# Altium project MiniPC MB GOST.PrjPcb (part 28 of 31)
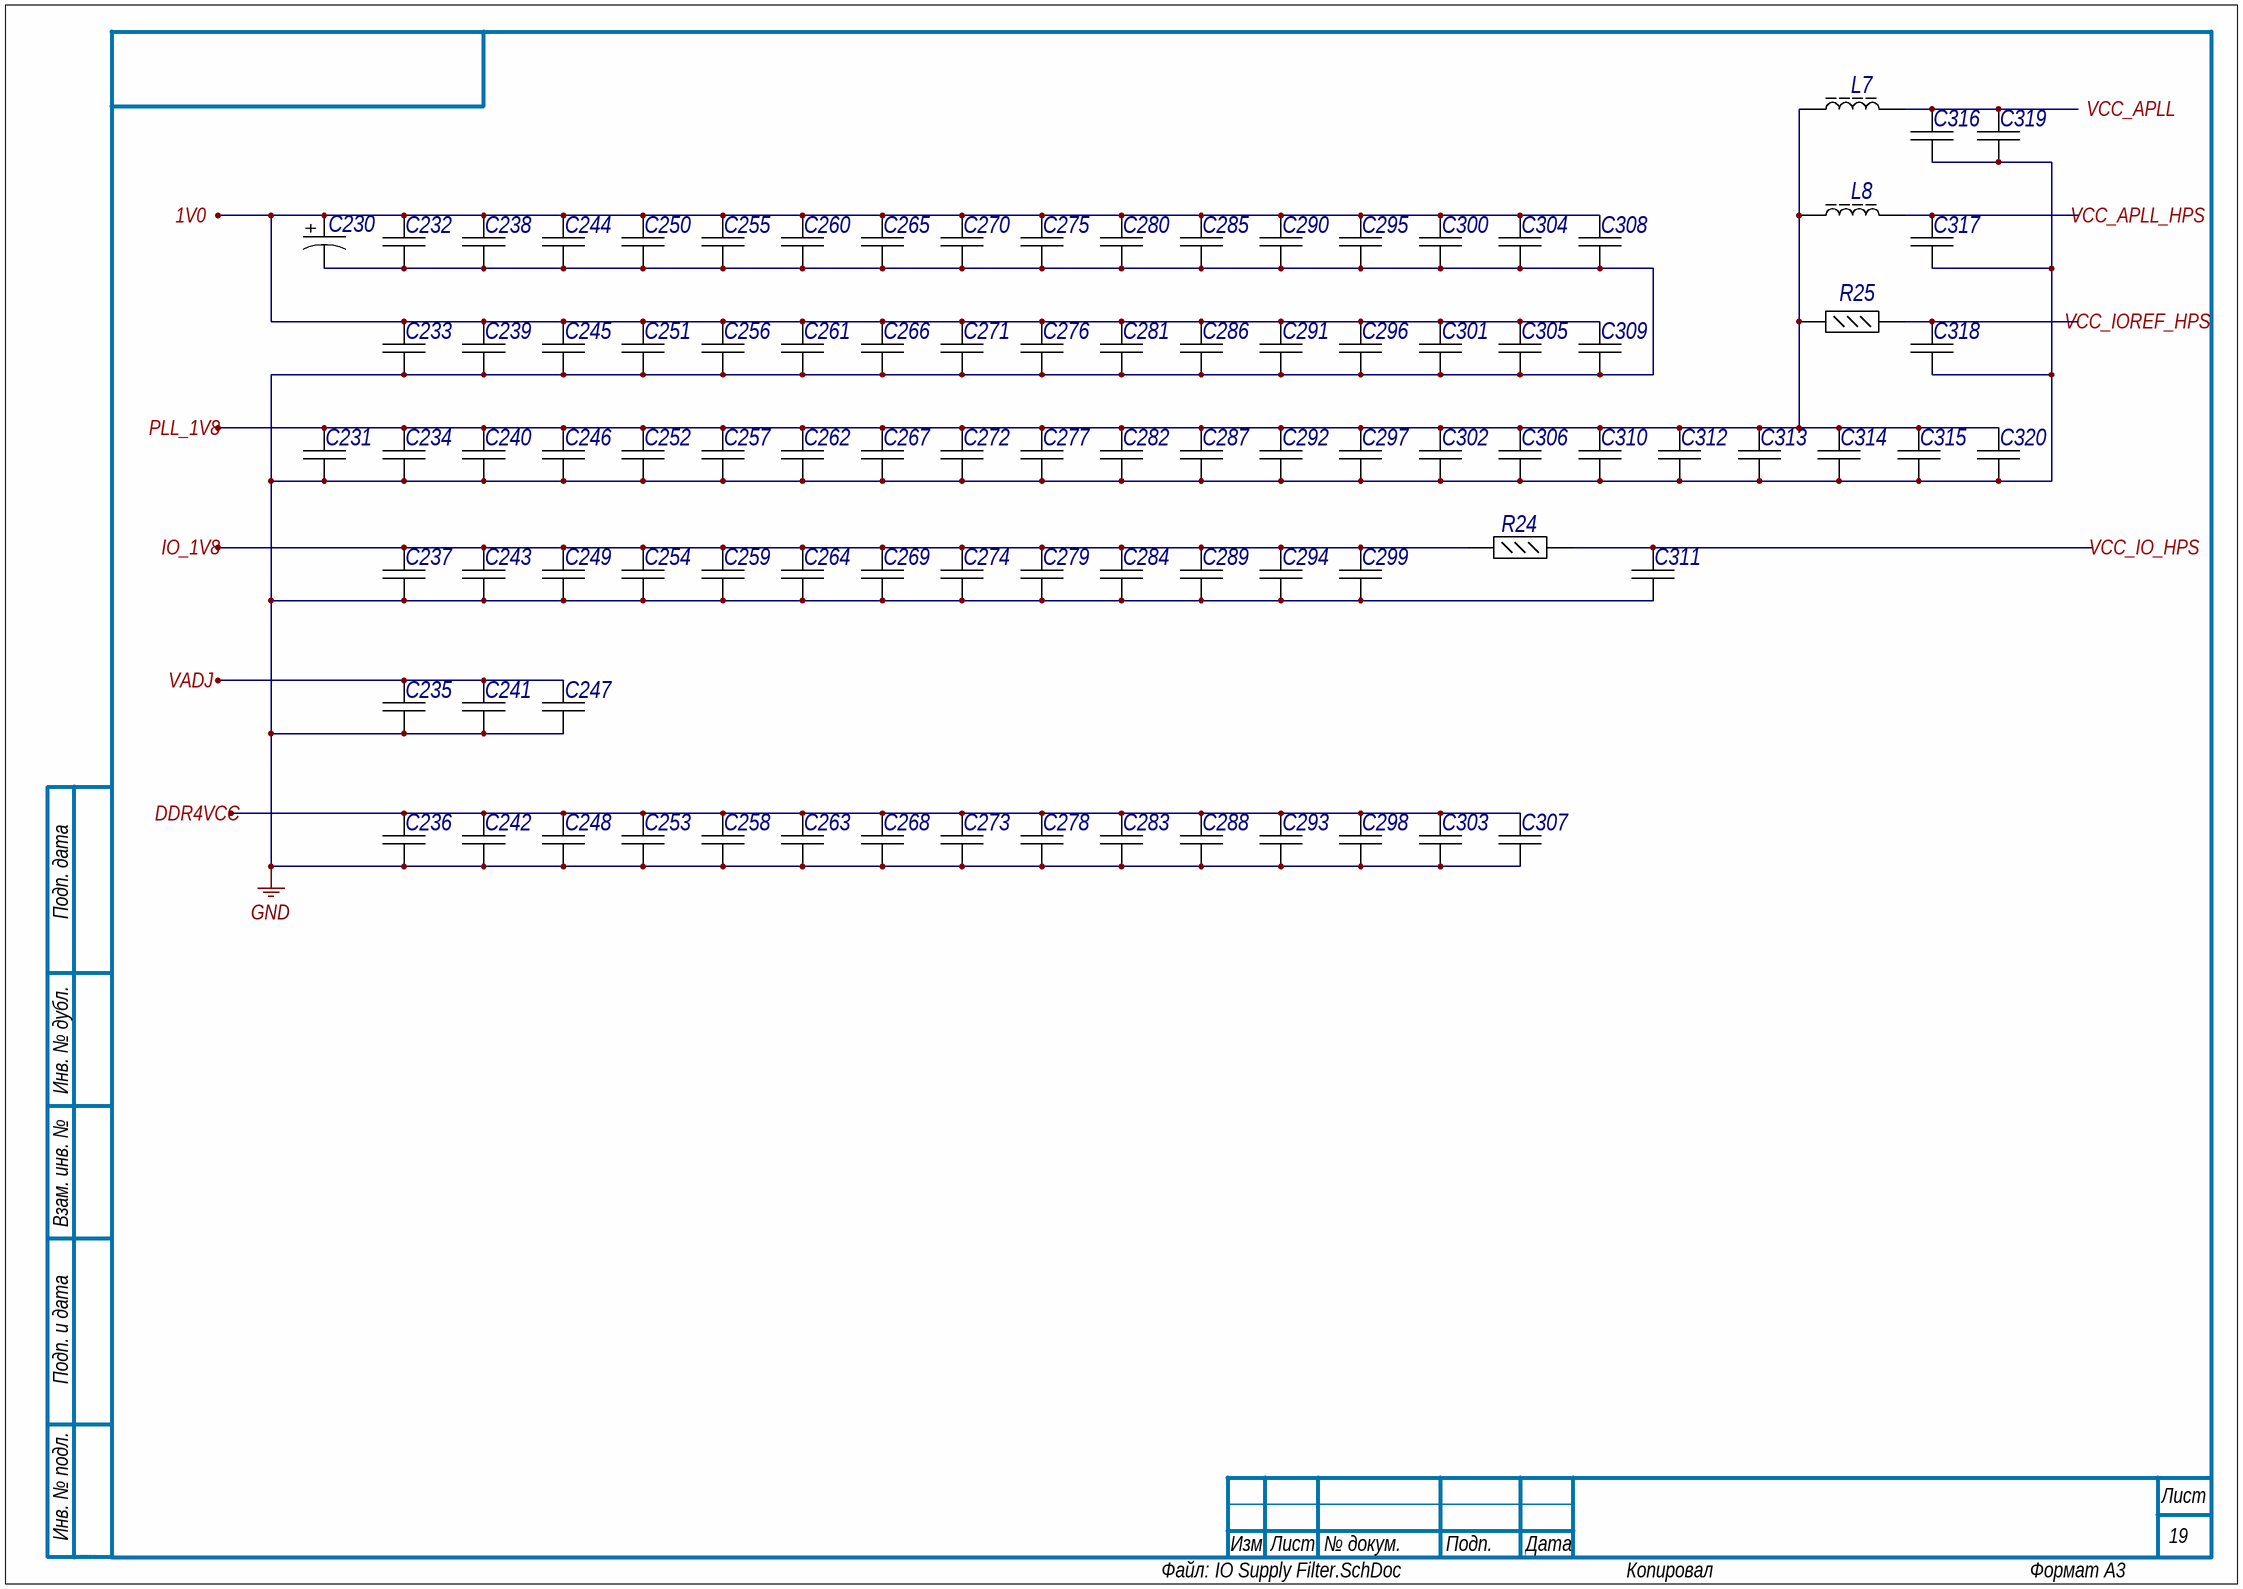
[diagram p55: IO Supply Filter.SchDoc]

## Sheet IO Supply Filter.SchDoc (continued)
### Library data of the parts
C230 = E26: Tantalum Capacitor, 330 uF, +/- 20%, 2.5 V, -55 to 105 degC, 2-Pin Molded, RoHS, Tape and Reel; Тип элемента: Конденсатор поляризованный; Capacitance: 330 uF; Old_des: C390; New_des: C230; UID: E26; Component Kind: Standard; Case/Package: 1411; ComponentLink1Description: Manufacturer URL; ComponentLink1URL: http://www.kemet.com/; ComponentLink2Description: Datasheet; ComponentLink2URL: http://capacitoredge.kemet.com/capedge2/DataSheet?pn=T520B337M2R5ATE045; DatasheetVersion: 07/2016; Length: 3.5 mm; Max Operating Temperature: 105 degC; Min Operating Temperature: -55 degC; Mounting Technology: Surface Mount; Package Quantity: 2000; PackageDescription: 2-Pin Surface Mount Device, Body 3.5 x 2.8 mm; Packaging: Tape and Reel; PartNumber: T520B337M2R5ATE045; RoHSCompliant: True; Width: 2.8 mm; Height: 2.1 mm; Mount: Surface Mount; Radiation Hardening: No
C231 = E14: Chip Capacitor, 100 uF, +/- 20%, 6.3 V, -55 to 85 degC, 1206 (3216 Metric), RoHS, Tape and Reel; Тип элемента: Конденсатор; Capacitance: 100 uF; Case\/Package: 1206; Type (Capacitors): X5R; Voltage Rating: 6.3 V; Old_des: C423; New_des: C231; UID: E14; Component Kind: Standard; Case Code (Imperial): 1206; Case Code (Metric): 3216; ComponentLink1Description: Manufacturer URL; ComponentLink1URL: http://www.murata.com/; ComponentLink2Description: Datasheet; ComponentLink2URL: http://psearch.en.murata.com/capacitor/product/GRM31CR60J107ME39%23.pdf; DatasheetVersion: 09/2016; Length: 3.2 mm; Max Operating Temperature: 85 degC; Min Operating Temperature: -55 degC; Mounting Technology: Surface Mount; Package Quantity: 2000; PackageDescription: 2-Pin Surface Mount Device, Body 3.2 x 1.6 mm; Packaging: Tape and Reel; PartNumber: GRM31CR60J107ME39L; RoHSCompliant: true; Tolerance: 20%; Width: 1.6 mm; Height: 1.6 mm; Mount: Surface Mount; PackageReference: 1206; Pins: 2; Radiation Hardening: No; REACH SVHC: No SVHC; Voltage Rating (DC): 6.3 V
C232 = E22: Chip Capacitor, 100 nF, +/- 10%, 6.3 V, -55 to 85 degC, 0201 (0603 Metric), RoHS, Tape and Reel; Manufacturer: Basic Passives; Тип элемента: Конденсатор; Capacitance: 100 nF; Case\/Package: 0201; Type (Capacitors): X5R; Voltage Rating: 6.3 V; Voltage Rating (DC): 3 V; Old_des: C391; New_des: C232; UID: E22; Component Kind: Standard; Case Code (Imperial): 0201; Case Code (Metric): 0603; ComponentLink1Description: Manufacturer URL; ComponentLink1URL: http://www.murata.com/; ComponentLink2Description: Datasheet; ComponentLink2URL: http://search.murata.co.jp/Ceramy/image/img/A01X/G101/ENG/GRM033R60J104KE19-01.pdf; DatasheetVersion: 03/2016; Length: 0.6 mm; Max Operating Temperature: 85 degC; Min Operating Temperature: -55 degC; Mounting Technology: Surface Mount; Package Quantity: 15000; PackageDescription: 2-Pin Surface Mount Device, Body 0.6 x 0.3 mm; Packaging: Tape and Reel; PartNumber: GRM033R60J104KE19D; RoHSCompliant: true; Tolerance: 10%; Width: 0.3 mm; Height: 0.3 mm; Mount: Surface Mount; PackageReference: 0201; Pins: 2; Radiation Hardening: No; REACH SVHC: No SVHC
C233 = E27: Chip Capacitor, 4.7 uF, +/- 20%, 6.3 V, -55 to 85 degC, 0402 (1005 Metric), RoHS, Tape and Reel; Manufacturer: Basic Passives; Тип элемента: Конденсатор; Capacitance: 4.7 uF; Case\/Package: 0402; Type (Capacitors): X5R; Voltage Rating: 6.3 V; Old_des: C407; New_des: C233; UID: E27; Component Kind: Standard; Case Code (Imperial): 0402; Case Code (Metric): 1005; ComponentLink1Description: Manufacturer URL; ComponentLink1URL: http://www.murata.com/; ComponentLink2Description: Datasheet; ComponentLink2URL: http://search.murata.co.jp/Ceramy/image/img/A01X/G101/ENG/GRM155R60J475ME87-01.pdf; DatasheetVersion: 03/2016; Length: 0.039 inch; Max Operating Temperature: 85 degC; Min Operating Temperature: -55 degC; Mounting Technology: Surface Mount; Package Quantity: 1; PackageDescription: 2-Pin Surface Mount Device, Body 1 x 0.5 mm; Packaging: Tape and Reel; PartNumber: GRM155R60J475ME87D; RoHSCompliant: true; Tolerance: 20%; Width: 0.02 inch; Height: 0.5 mm; Mount: Surface Mount; PackageReference: 0402; Pins: 2; Radiation Hardening: No; REACH SVHC: No SVHC; Voltage Rating (DC): 6.3 V
C234 = E22: Chip Capacitor, 100 nF, +/- 10%, 6.3 V, -55 to 85 degC, 0201 (0603 Metric), RoHS, Tape and Reel; Manufacturer: Basic Passives; Тип элемента: Конденсатор; Capacitance: 100 nF; Case\/Package: 0201; Type (Capacitors): X5R; Voltage Rating: 6.3 V; Voltage Rating (DC): 3 V; Old_des: C424; New_des: C234; UID: E22; Component Kind: Standard; Case Code (Imperial): 0201; Case Code (Metric): 0603; ComponentLink1Description: Manufacturer URL; ComponentLink1URL: http://www.murata.com/; ComponentLink2Description: Datasheet; ComponentLink2URL: http://search.murata.co.jp/Ceramy/image/img/A01X/G101/ENG/GRM033R60J104KE19-01.pdf; DatasheetVersion: 03/2016; Length: 0.6 mm; Max Operating Temperature: 85 degC; Min Operating Temperature: -55 degC; Mounting Technology: Surface Mount; Package Quantity: 15000; PackageDescription: 2-Pin Surface Mount Device, Body 0.6 x 0.3 mm; Packaging: Tape and Reel; PartNumber: GRM033R60J104KE19D; RoHSCompliant: true; Tolerance: 10%; Width: 0.3 mm; Height: 0.3 mm; Mount: Surface Mount; PackageReference: 0201; Pins: 2; Radiation Hardening: No; REACH SVHC: No SVHC
C235 = E22: Chip Capacitor, 100 nF, +/- 10%, 6.3 V, -55 to 85 degC, 0201 (0603 Metric), RoHS, Tape and Reel; Manufacturer: Basic Passives; Тип элемента: Конденсатор; Capacitance: 100 nF; Case\/Package: 0201; Type (Capacitors): X5R; Voltage Rating: 6.3 V; Voltage Rating (DC): 3 V; Old_des: C460; New_des: C235; UID: E22; Component Kind: Standard; Case Code (Imperial): 0201; Case Code (Metric): 0603; ComponentLink1Description: Manufacturer URL; ComponentLink1URL: http://www.murata.com/; ComponentLink2Description: Datasheet; ComponentLink2URL: http://search.murata.co.jp/Ceramy/image/img/A01X/G101/ENG/GRM033R60J104KE19-01.pdf; DatasheetVersion: 03/2016; Length: 0.6 mm; Max Operating Temperature: 85 degC; Min Operating Temperature: -55 degC; Mounting Technology: Surface Mount; Package Quantity: 15000; PackageDescription: 2-Pin Surface Mount Device, Body 0.6 x 0.3 mm; Packaging: Tape and Reel; PartNumber: GRM033R60J104KE19D; RoHSCompliant: true; Tolerance: 10%; Width: 0.3 mm; Height: 0.3 mm; Mount: Surface Mount; PackageReference: 0201; Pins: 2; Radiation Hardening: No; REACH SVHC: No SVHC
C236 = E22: Chip Capacitor, 100 nF, +/- 10%, 6.3 V, -55 to 85 degC, 0201 (0603 Metric), RoHS, Tape and Reel; Manufacturer: Basic Passives; Тип элемента: Конденсатор; Capacitance: 100 nF; Case\/Package: 0201; Type (Capacitors): X5R; Voltage Rating: 6.3 V; Voltage Rating (DC): 3 V; Old_des: C465; New_des: C236; UID: E22; Component Kind: Standard; Case Code (Imperial): 0201; Case Code (Metric): 0603; ComponentLink1Description: Manufacturer URL; ComponentLink1URL: http://www.murata.com/; ComponentLink2Description: Datasheet; ComponentLink2URL: http://search.murata.co.jp/Ceramy/image/img/A01X/G101/ENG/GRM033R60J104KE19-01.pdf; DatasheetVersion: 03/2016; Length: 0.6 mm; Max Operating Temperature: 85 degC; Min Operating Temperature: -55 degC; Mounting Technology: Surface Mount; Package Quantity: 15000; PackageDescription: 2-Pin Surface Mount Device, Body 0.6 x 0.3 mm; Packaging: Tape and Reel; PartNumber: GRM033R60J104KE19D; RoHSCompliant: true; Tolerance: 10%; Width: 0.3 mm; Height: 0.3 mm; Mount: Surface Mount; PackageReference: 0201; Pins: 2; Radiation Hardening: No; REACH SVHC: No SVHC
C237 = E22: Chip Capacitor, 100 nF, +/- 10%, 6.3 V, -55 to 85 degC, 0201 (0603 Metric), RoHS, Tape and Reel; Manufacturer: Basic Passives; Тип элемента: Конденсатор; Capacitance: 100 nF; Case\/Package: 0201; Type (Capacitors): X5R; Voltage Rating: 6.3 V; Voltage Rating (DC): 3 V; Old_des: C445; New_des: C237; UID: E22; Component Kind: Standard; Case Code (Imperial): 0201; Case Code (Metric): 0603; ComponentLink1Description: Manufacturer URL; ComponentLink1URL: http://www.murata.com/; ComponentLink2Description: Datasheet; ComponentLink2URL: http://search.murata.co.jp/Ceramy/image/img/A01X/G101/ENG/GRM033R60J104KE19-01.pdf; DatasheetVersion: 03/2016; Length: 0.6 mm; Max Operating Temperature: 85 degC; Min Operating Temperature: -55 degC; Mounting Technology: Surface Mount; Package Quantity: 15000; PackageDescription: 2-Pin Surface Mount Device, Body 0.6 x 0.3 mm; Packaging: Tape and Reel; PartNumber: GRM033R60J104KE19D; RoHSCompliant: true; Tolerance: 10%; Width: 0.3 mm; Height: 0.3 mm; Mount: Surface Mount; PackageReference: 0201; Pins: 2; Radiation Hardening: No; REACH SVHC: No SVHC
C238 = E22: Chip Capacitor, 100 nF, +/- 10%, 6.3 V, -55 to 85 degC, 0201 (0603 Metric), RoHS, Tape and Reel; Manufacturer: Basic Passives; Тип элемента: Конденсатор; Capacitance: 100 nF; Case\/Package: 0201; Type (Capacitors): X5R; Voltage Rating: 6.3 V; Voltage Rating (DC): 3 V; Old_des: C392; New_des: C238; UID: E22; Component Kind: Standard; Case Code (Imperial): 0201; Case Code (Metric): 0603; ComponentLink1Description: Manufacturer URL; ComponentLink1URL: http://www.murata.com/; ComponentLink2Description: Datasheet; ComponentLink2URL: http://search.murata.co.jp/Ceramy/image/img/A01X/G101/ENG/GRM033R60J104KE19-01.pdf; DatasheetVersion: 03/2016; Length: 0.6 mm; Max Operating Temperature: 85 degC; Min Operating Temperature: -55 degC; Mounting Technology: Surface Mount; Package Quantity: 15000; PackageDescription: 2-Pin Surface Mount Device, Body 0.6 x 0.3 mm; Packaging: Tape and Reel; PartNumber: GRM033R60J104KE19D; RoHSCompliant: true; Tolerance: 10%; Width: 0.3 mm; Height: 0.3 mm; Mount: Surface Mount; PackageReference: 0201; Pins: 2; Radiation Hardening: No; REACH SVHC: No SVHC
C239 = E27: Chip Capacitor, 4.7 uF, +/- 20%, 6.3 V, -55 to 85 degC, 0402 (1005 Metric), RoHS, Tape and Reel; Manufacturer: Basic Passives; Тип элемента: Конденсатор; Capacitance: 4.7 uF; Case\/Package: 0402; Type (Capacitors): X5R; Voltage Rating: 6.3 V; Old_des: C408; New_des: C239; UID: E27; Component Kind: Standard; Case Code (Imperial): 0402; Case Code (Metric): 1005; ComponentLink1Description: Manufacturer URL; ComponentLink1URL: http://www.murata.com/; ComponentLink2Description: Datasheet; ComponentLink2URL: http://search.murata.co.jp/Ceramy/image/img/A01X/G101/ENG/GRM155R60J475ME87-01.pdf; DatasheetVersion: 03/2016; Length: 0.039 inch; Max Operating Temperature: 85 degC; Min Operating Temperature: -55 degC; Mounting Technology: Surface Mount; Package Quantity: 1; PackageDescription: 2-Pin Surface Mount Device, Body 1 x 0.5 mm; Packaging: Tape and Reel; PartNumber: GRM155R60J475ME87D; RoHSCompliant: true; Tolerance: 20%; Width: 0.02 inch; Height: 0.5 mm; Mount: Surface Mount; PackageReference: 0402; Pins: 2; Radiation Hardening: No; REACH SVHC: No SVHC; Voltage Rating (DC): 6.3 V
C240 = E22: Chip Capacitor, 100 nF, +/- 10%, 6.3 V, -55 to 85 degC, 0201 (0603 Metric), RoHS, Tape and Reel; Manufacturer: Basic Passives; Тип элемента: Конденсатор; Capacitance: 100 nF; Case\/Package: 0201; Type (Capacitors): X5R; Voltage Rating: 6.3 V; Voltage Rating (DC): 3 V; Old_des: C425; New_des: C240; UID: E22; Component Kind: Standard; Case Code (Imperial): 0201; Case Code (Metric): 0603; ComponentLink1Description: Manufacturer URL; ComponentLink1URL: http://www.murata.com/; ComponentLink2Description: Datasheet; ComponentLink2URL: http://search.murata.co.jp/Ceramy/image/img/A01X/G101/ENG/GRM033R60J104KE19-01.pdf; DatasheetVersion: 03/2016; Length: 0.6 mm; Max Operating Temperature: 85 degC; Min Operating Temperature: -55 degC; Mounting Technology: Surface Mount; Package Quantity: 15000; PackageDescription: 2-Pin Surface Mount Device, Body 0.6 x 0.3 mm; Packaging: Tape and Reel; PartNumber: GRM033R60J104KE19D; RoHSCompliant: true; Tolerance: 10%; Width: 0.3 mm; Height: 0.3 mm; Mount: Surface Mount; PackageReference: 0201; Pins: 2; Radiation Hardening: No; REACH SVHC: No SVHC
C241 = E22: Chip Capacitor, 100 nF, +/- 10%, 6.3 V, -55 to 85 degC, 0201 (0603 Metric), RoHS, Tape and Reel; Manufacturer: Basic Passives; Тип элемента: Конденсатор; Capacitance: 100 nF; Case\/Package: 0201; Type (Capacitors): X5R; Voltage Rating: 6.3 V; Voltage Rating (DC): 3 V; Old_des: C461; New_des: C241; UID: E22; Component Kind: Standard; Case Code (Imperial): 0201; Case Code (Metric): 0603; ComponentLink1Description: Manufacturer URL; ComponentLink1URL: http://www.murata.com/; ComponentLink2Description: Datasheet; ComponentLink2URL: http://search.murata.co.jp/Ceramy/image/img/A01X/G101/ENG/GRM033R60J104KE19-01.pdf; DatasheetVersion: 03/2016; Length: 0.6 mm; Max Operating Temperature: 85 degC; Min Operating Temperature: -55 degC; Mounting Technology: Surface Mount; Package Quantity: 15000; PackageDescription: 2-Pin Surface Mount Device, Body 0.6 x 0.3 mm; Packaging: Tape and Reel; PartNumber: GRM033R60J104KE19D; RoHSCompliant: true; Tolerance: 10%; Width: 0.3 mm; Height: 0.3 mm; Mount: Surface Mount; PackageReference: 0201; Pins: 2; Radiation Hardening: No; REACH SVHC: No SVHC
C242 = E22: Chip Capacitor, 100 nF, +/- 10%, 6.3 V, -55 to 85 degC, 0201 (0603 Metric), RoHS, Tape and Reel; Manufacturer: Basic Passives; Тип элемента: Конденсатор; Capacitance: 100 nF; Case\/Package: 0201; Type (Capacitors): X5R; Voltage Rating: 6.3 V; Voltage Rating (DC): 3 V; Old_des: C466; New_des: C242; UID: E22; Component Kind: Standard; Case Code (Imperial): 0201; Case Code (Metric): 0603; ComponentLink1Description: Manufacturer URL; ComponentLink1URL: http://www.murata.com/; ComponentLink2Description: Datasheet; ComponentLink2URL: http://search.murata.co.jp/Ceramy/image/img/A01X/G101/ENG/GRM033R60J104KE19-01.pdf; DatasheetVersion: 03/2016; Length: 0.6 mm; Max Operating Temperature: 85 degC; Min Operating Temperature: -55 degC; Mounting Technology: Surface Mount; Package Quantity: 15000; PackageDescription: 2-Pin Surface Mount Device, Body 0.6 x 0.3 mm; Packaging: Tape and Reel; PartNumber: GRM033R60J104KE19D; RoHSCompliant: true; Tolerance: 10%; Width: 0.3 mm; Height: 0.3 mm; Mount: Surface Mount; PackageReference: 0201; Pins: 2; Radiation Hardening: No; REACH SVHC: No SVHC
C243 = E22: Chip Capacitor, 100 nF, +/- 10%, 6.3 V, -55 to 85 degC, 0201 (0603 Metric), RoHS, Tape and Reel; Manufacturer: Basic Passives; Тип элемента: Конденсатор; Capacitance: 100 nF; Case\/Package: 0201; Type (Capacitors): X5R; Voltage Rating: 6.3 V; Voltage Rating (DC): 3 V; Old_des: C446; New_des: C243; UID: E22; Component Kind: Standard; Case Code (Imperial): 0201; Case Code (Metric): 0603; ComponentLink1Description: Manufacturer URL; ComponentLink1URL: http://www.murata.com/; ComponentLink2Description: Datasheet; ComponentLink2URL: http://search.murata.co.jp/Ceramy/image/img/A01X/G101/ENG/GRM033R60J104KE19-01.pdf; DatasheetVersion: 03/2016; Length: 0.6 mm; Max Operating Temperature: 85 degC; Min Operating Temperature: -55 degC; Mounting Technology: Surface Mount; Package Quantity: 15000; PackageDescription: 2-Pin Surface Mount Device, Body 0.6 x 0.3 mm; Packaging: Tape and Reel; PartNumber: GRM033R60J104KE19D; RoHSCompliant: true; Tolerance: 10%; Width: 0.3 mm; Height: 0.3 mm; Mount: Surface Mount; PackageReference: 0201; Pins: 2; Radiation Hardening: No; REACH SVHC: No SVHC
C244 = E22: Chip Capacitor, 100 nF, +/- 10%, 6.3 V, -55 to 85 degC, 0201 (0603 Metric), RoHS, Tape and Reel; Manufacturer: Basic Passives; Тип элемента: Конденсатор; Capacitance: 100 nF; Case\/Package: 0201; Type (Capacitors): X5R; Voltage Rating: 6.3 V; Voltage Rating (DC): 3 V; Old_des: C393; New_des: C244; UID: E22; Component Kind: Standard; Case Code (Imperial): 0201; Case Code (Metric): 0603; ComponentLink1Description: Manufacturer URL; ComponentLink1URL: http://www.murata.com/; ComponentLink2Description: Datasheet; ComponentLink2URL: http://search.murata.co.jp/Ceramy/image/img/A01X/G101/ENG/GRM033R60J104KE19-01.pdf; DatasheetVersion: 03/2016; Length: 0.6 mm; Max Operating Temperature: 85 degC; Min Operating Temperature: -55 degC; Mounting Technology: Surface Mount; Package Quantity: 15000; PackageDescription: 2-Pin Surface Mount Device, Body 0.6 x 0.3 mm; Packaging: Tape and Reel; PartNumber: GRM033R60J104KE19D; RoHSCompliant: true; Tolerance: 10%; Width: 0.3 mm; Height: 0.3 mm; Mount: Surface Mount; PackageReference: 0201; Pins: 2; Radiation Hardening: No; REACH SVHC: No SVHC
C245 = E27: Chip Capacitor, 4.7 uF, +/- 20%, 6.3 V, -55 to 85 degC, 0402 (1005 Metric), RoHS, Tape and Reel; Manufacturer: Basic Passives; Тип элемента: Конденсатор; Capacitance: 4.7 uF; Case\/Package: 0402; Type (Capacitors): X5R; Voltage Rating: 6.3 V; Old_des: C409; New_des: C245; UID: E27; Component Kind: Standard; Case Code (Imperial): 0402; Case Code (Metric): 1005; ComponentLink1Description: Manufacturer URL; ComponentLink1URL: http://www.murata.com/; ComponentLink2Description: Datasheet; ComponentLink2URL: http://search.murata.co.jp/Ceramy/image/img/A01X/G101/ENG/GRM155R60J475ME87-01.pdf; DatasheetVersion: 03/2016; Length: 0.039 inch; Max Operating Temperature: 85 degC; Min Operating Temperature: -55 degC; Mounting Technology: Surface Mount; Package Quantity: 1; PackageDescription: 2-Pin Surface Mount Device, Body 1 x 0.5 mm; Packaging: Tape and Reel; PartNumber: GRM155R60J475ME87D; RoHSCompliant: true; Tolerance: 20%; Width: 0.02 inch; Height: 0.5 mm; Mount: Surface Mount; PackageReference: 0402; Pins: 2; Radiation Hardening: No; REACH SVHC: No SVHC; Voltage Rating (DC): 6.3 V
C246 = E22: Chip Capacitor, 100 nF, +/- 10%, 6.3 V, -55 to 85 degC, 0201 (0603 Metric), RoHS, Tape and Reel; Manufacturer: Basic Passives; Тип элемента: Конденсатор; Capacitance: 100 nF; Case\/Package: 0201; Type (Capacitors): X5R; Voltage Rating: 6.3 V; Voltage Rating (DC): 3 V; Old_des: C426; New_des: C246; UID: E22; Component Kind: Standard; Case Code (Imperial): 0201; Case Code (Metric): 0603; ComponentLink1Description: Manufacturer URL; ComponentLink1URL: http://www.murata.com/; ComponentLink2Description: Datasheet; ComponentLink2URL: http://search.murata.co.jp/Ceramy/image/img/A01X/G101/ENG/GRM033R60J104KE19-01.pdf; DatasheetVersion: 03/2016; Length: 0.6 mm; Max Operating Temperature: 85 degC; Min Operating Temperature: -55 degC; Mounting Technology: Surface Mount; Package Quantity: 15000; PackageDescription: 2-Pin Surface Mount Device, Body 0.6 x 0.3 mm; Packaging: Tape and Reel; PartNumber: GRM033R60J104KE19D; RoHSCompliant: true; Tolerance: 10%; Width: 0.3 mm; Height: 0.3 mm; Mount: Surface Mount; PackageReference: 0201; Pins: 2; Radiation Hardening: No; REACH SVHC: No SVHC
C247 = E22: Chip Capacitor, 100 nF, +/- 10%, 6.3 V, -55 to 85 degC, 0201 (0603 Metric), RoHS, Tape and Reel; Manufacturer: Basic Passives; Тип элемента: Конденсатор; Capacitance: 100 nF; Case\/Package: 0201; Type (Capacitors): X5R; Voltage Rating: 6.3 V; Voltage Rating (DC): 3 V; Old_des: C462; New_des: C247; UID: E22; Component Kind: Standard; Case Code (Imperial): 0201; Case Code (Metric): 0603; ComponentLink1Description: Manufacturer URL; ComponentLink1URL: http://www.murata.com/; ComponentLink2Description: Datasheet; ComponentLink2URL: http://search.murata.co.jp/Ceramy/image/img/A01X/G101/ENG/GRM033R60J104KE19-01.pdf; DatasheetVersion: 03/2016; Length: 0.6 mm; Max Operating Temperature: 85 degC; Min Operating Temperature: -55 degC; Mounting Technology: Surface Mount; Package Quantity: 15000; PackageDescription: 2-Pin Surface Mount Device, Body 0.6 x 0.3 mm; Packaging: Tape and Reel; PartNumber: GRM033R60J104KE19D; RoHSCompliant: true; Tolerance: 10%; Width: 0.3 mm; Height: 0.3 mm; Mount: Surface Mount; PackageReference: 0201; Pins: 2; Radiation Hardening: No; REACH SVHC: No SVHC
C248 = E22: Chip Capacitor, 100 nF, +/- 10%, 6.3 V, -55 to 85 degC, 0201 (0603 Metric), RoHS, Tape and Reel; Manufacturer: Basic Passives; Тип элемента: Конденсатор; Capacitance: 100 nF; Case\/Package: 0201; Type (Capacitors): X5R; Voltage Rating: 6.3 V; Voltage Rating (DC): 3 V; Old_des: C467; New_des: C248; UID: E22; Component Kind: Standard; Case Code (Imperial): 0201; Case Code (Metric): 0603; ComponentLink1Description: Manufacturer URL; ComponentLink1URL: http://www.murata.com/; ComponentLink2Description: Datasheet; ComponentLink2URL: http://search.murata.co.jp/Ceramy/image/img/A01X/G101/ENG/GRM033R60J104KE19-01.pdf; DatasheetVersion: 03/2016; Length: 0.6 mm; Max Operating Temperature: 85 degC; Min Operating Temperature: -55 degC; Mounting Technology: Surface Mount; Package Quantity: 15000; PackageDescription: 2-Pin Surface Mount Device, Body 0.6 x 0.3 mm; Packaging: Tape and Reel; PartNumber: GRM033R60J104KE19D; RoHSCompliant: true; Tolerance: 10%; Width: 0.3 mm; Height: 0.3 mm; Mount: Surface Mount; PackageReference: 0201; Pins: 2; Radiation Hardening: No; REACH SVHC: No SVHC
C249 = E22: Chip Capacitor, 100 nF, +/- 10%, 6.3 V, -55 to 85 degC, 0201 (0603 Metric), RoHS, Tape and Reel; Manufacturer: Basic Passives; Тип элемента: Конденсатор; Capacitance: 100 nF; Case\/Package: 0201; Type (Capacitors): X5R; Voltage Rating: 6.3 V; Voltage Rating (DC): 3 V; Old_des: C447; New_des: C249; UID: E22; Component Kind: Standard; Case Code (Imperial): 0201; Case Code (Metric): 0603; ComponentLink1Description: Manufacturer URL; ComponentLink1URL: http://www.murata.com/; ComponentLink2Description: Datasheet; ComponentLink2URL: http://search.murata.co.jp/Ceramy/image/img/A01X/G101/ENG/GRM033R60J104KE19-01.pdf; DatasheetVersion: 03/2016; Length: 0.6 mm; Max Operating Temperature: 85 degC; Min Operating Temperature: -55 degC; Mounting Technology: Surface Mount; Package Quantity: 15000; PackageDescription: 2-Pin Surface Mount Device, Body 0.6 x 0.3 mm; Packaging: Tape and Reel; PartNumber: GRM033R60J104KE19D; RoHSCompliant: true; Tolerance: 10%; Width: 0.3 mm; Height: 0.3 mm; Mount: Surface Mount; PackageReference: 0201; Pins: 2; Radiation Hardening: No; REACH SVHC: No SVHC
C250 = E22: Chip Capacitor, 100 nF, +/- 10%, 6.3 V, -55 to 85 degC, 0201 (0603 Metric), RoHS, Tape and Reel; Manufacturer: Basic Passives; Тип элемента: Конденсатор; Capacitance: 100 nF; Case\/Package: 0201; Type (Capacitors): X5R; Voltage Rating: 6.3 V; Voltage Rating (DC): 3 V; Old_des: C394; New_des: C250; UID: E22; Component Kind: Standard; Case Code (Imperial): 0201; Case Code (Metric): 0603; ComponentLink1Description: Manufacturer URL; ComponentLink1URL: http://www.murata.com/; ComponentLink2Description: Datasheet; ComponentLink2URL: http://search.murata.co.jp/Ceramy/image/img/A01X/G101/ENG/GRM033R60J104KE19-01.pdf; DatasheetVersion: 03/2016; Length: 0.6 mm; Max Operating Temperature: 85 degC; Min Operating Temperature: -55 degC; Mounting Technology: Surface Mount; Package Quantity: 15000; PackageDescription: 2-Pin Surface Mount Device, Body 0.6 x 0.3 mm; Packaging: Tape and Reel; PartNumber: GRM033R60J104KE19D; RoHSCompliant: true; Tolerance: 10%; Width: 0.3 mm; Height: 0.3 mm; Mount: Surface Mount; PackageReference: 0201; Pins: 2; Radiation Hardening: No; REACH SVHC: No SVHC
C251 = E27: Chip Capacitor, 4.7 uF, +/- 20%, 6.3 V, -55 to 85 degC, 0402 (1005 Metric), RoHS, Tape and Reel; Manufacturer: Basic Passives; Тип элемента: Конденсатор; Capacitance: 4.7 uF; Case\/Package: 0402; Type (Capacitors): X5R; Voltage Rating: 6.3 V; Old_des: C410; New_des: C251; UID: E27; Component Kind: Standard; Case Code (Imperial): 0402; Case Code (Metric): 1005; ComponentLink1Description: Manufacturer URL; ComponentLink1URL: http://www.murata.com/; ComponentLink2Description: Datasheet; ComponentLink2URL: http://search.murata.co.jp/Ceramy/image/img/A01X/G101/ENG/GRM155R60J475ME87-01.pdf; DatasheetVersion: 03/2016; Length: 0.039 inch; Max Operating Temperature: 85 degC; Min Operating Temperature: -55 degC; Mounting Technology: Surface Mount; Package Quantity: 1; PackageDescription: 2-Pin Surface Mount Device, Body 1 x 0.5 mm; Packaging: Tape and Reel; PartNumber: GRM155R60J475ME87D; RoHSCompliant: true; Tolerance: 20%; Width: 0.02 inch; Height: 0.5 mm; Mount: Surface Mount; PackageReference: 0402; Pins: 2; Radiation Hardening: No; REACH SVHC: No SVHC; Voltage Rating (DC): 6.3 V
C252 = E22: Chip Capacitor, 100 nF, +/- 10%, 6.3 V, -55 to 85 degC, 0201 (0603 Metric), RoHS, Tape and Reel; Manufacturer: Basic Passives; Тип элемента: Конденсатор; Capacitance: 100 nF; Case\/Package: 0201; Type (Capacitors): X5R; Voltage Rating: 6.3 V; Voltage Rating (DC): 3 V; Old_des: C427; New_des: C252; UID: E22; Component Kind: Standard; Case Code (Imperial): 0201; Case Code (Metric): 0603; ComponentLink1Description: Manufacturer URL; ComponentLink1URL: http://www.murata.com/; ComponentLink2Description: Datasheet; ComponentLink2URL: http://search.murata.co.jp/Ceramy/image/img/A01X/G101/ENG/GRM033R60J104KE19-01.pdf; DatasheetVersion: 03/2016; Length: 0.6 mm; Max Operating Temperature: 85 degC; Min Operating Temperature: -55 degC; Mounting Technology: Surface Mount; Package Quantity: 15000; PackageDescription: 2-Pin Surface Mount Device, Body 0.6 x 0.3 mm; Packaging: Tape and Reel; PartNumber: GRM033R60J104KE19D; RoHSCompliant: true; Tolerance: 10%; Width: 0.3 mm; Height: 0.3 mm; Mount: Surface Mount; PackageReference: 0201; Pins: 2; Radiation Hardening: No; REACH SVHC: No SVHC
C253 = E22: Chip Capacitor, 100 nF, +/- 10%, 6.3 V, -55 to 85 degC, 0201 (0603 Metric), RoHS, Tape and Reel; Manufacturer: Basic Passives; Тип элемента: Конденсатор; Capacitance: 100 nF; Case\/Package: 0201; Type (Capacitors): X5R; Voltage Rating: 6.3 V; Voltage Rating (DC): 3 V; Old_des: C468; New_des: C253; UID: E22; Component Kind: Standard; Case Code (Imperial): 0201; Case Code (Metric): 0603; ComponentLink1Description: Manufacturer URL; ComponentLink1URL: http://www.murata.com/; ComponentLink2Description: Datasheet; ComponentLink2URL: http://search.murata.co.jp/Ceramy/image/img/A01X/G101/ENG/GRM033R60J104KE19-01.pdf; DatasheetVersion: 03/2016; Length: 0.6 mm; Max Operating Temperature: 85 degC; Min Operating Temperature: -55 degC; Mounting Technology: Surface Mount; Package Quantity: 15000; PackageDescription: 2-Pin Surface Mount Device, Body 0.6 x 0.3 mm; Packaging: Tape and Reel; PartNumber: GRM033R60J104KE19D; RoHSCompliant: true; Tolerance: 10%; Width: 0.3 mm; Height: 0.3 mm; Mount: Surface Mount; PackageReference: 0201; Pins: 2; Radiation Hardening: No; REACH SVHC: No SVHC
C254 = E22: Chip Capacitor, 100 nF, +/- 10%, 6.3 V, -55 to 85 degC, 0201 (0603 Metric), RoHS, Tape and Reel; Manufacturer: Basic Passives; Тип элемента: Конденсатор; Capacitance: 100 nF; Case\/Package: 0201; Type (Capacitors): X5R; Voltage Rating: 6.3 V; Voltage Rating (DC): 3 V; Old_des: C448; New_des: C254; UID: E22; Component Kind: Standard; Case Code (Imperial): 0201; Case Code (Metric): 0603; ComponentLink1Description: Manufacturer URL; ComponentLink1URL: http://www.murata.com/; ComponentLink2Description: Datasheet; ComponentLink2URL: http://search.murata.co.jp/Ceramy/image/img/A01X/G101/ENG/GRM033R60J104KE19-01.pdf; DatasheetVersion: 03/2016; Length: 0.6 mm; Max Operating Temperature: 85 degC; Min Operating Temperature: -55 degC; Mounting Technology: Surface Mount; Package Quantity: 15000; PackageDescription: 2-Pin Surface Mount Device, Body 0.6 x 0.3 mm; Packaging: Tape and Reel; PartNumber: GRM033R60J104KE19D; RoHSCompliant: true; Tolerance: 10%; Width: 0.3 mm; Height: 0.3 mm; Mount: Surface Mount; PackageReference: 0201; Pins: 2; Radiation Hardening: No; REACH SVHC: No SVHC
C255 = E22: Chip Capacitor, 100 nF, +/- 10%, 6.3 V, -55 to 85 degC, 0201 (0603 Metric), RoHS, Tape and Reel; Manufacturer: Basic Passives; Тип элемента: Конденсатор; Capacitance: 100 nF; Case\/Package: 0201; Type (Capacitors): X5R; Voltage Rating: 6.3 V; Voltage Rating (DC): 3 V; Old_des: C395; New_des: C255; UID: E22; Component Kind: Standard; Case Code (Imperial): 0201; Case Code (Metric): 0603; ComponentLink1Description: Manufacturer URL; ComponentLink1URL: http://www.murata.com/; ComponentLink2Description: Datasheet; ComponentLink2URL: http://search.murata.co.jp/Ceramy/image/img/A01X/G101/ENG/GRM033R60J104KE19-01.pdf; DatasheetVersion: 03/2016; Length: 0.6 mm; Max Operating Temperature: 85 degC; Min Operating Temperature: -55 degC; Mounting Technology: Surface Mount; Package Quantity: 15000; PackageDescription: 2-Pin Surface Mount Device, Body 0.6 x 0.3 mm; Packaging: Tape and Reel; PartNumber: GRM033R60J104KE19D; RoHSCompliant: true; Tolerance: 10%; Width: 0.3 mm; Height: 0.3 mm; Mount: Surface Mount; PackageReference: 0201; Pins: 2; Radiation Hardening: No; REACH SVHC: No SVHC
C256 = E27: Chip Capacitor, 4.7 uF, +/- 20%, 6.3 V, -55 to 85 degC, 0402 (1005 Metric), RoHS, Tape and Reel; Manufacturer: Basic Passives; Тип элемента: Конденсатор; Capacitance: 4.7 uF; Case\/Package: 0402; Type (Capacitors): X5R; Voltage Rating: 6.3 V; Old_des: C411; New_des: C256; UID: E27; Component Kind: Standard; Case Code (Imperial): 0402; Case Code (Metric): 1005; ComponentLink1Description: Manufacturer URL; ComponentLink1URL: http://www.murata.com/; ComponentLink2Description: Datasheet; ComponentLink2URL: http://search.murata.co.jp/Ceramy/image/img/A01X/G101/ENG/GRM155R60J475ME87-01.pdf; DatasheetVersion: 03/2016; Length: 0.039 inch; Max Operating Temperature: 85 degC; Min Operating Temperature: -55 degC; Mounting Technology: Surface Mount; Package Quantity: 1; PackageDescription: 2-Pin Surface Mount Device, Body 1 x 0.5 mm; Packaging: Tape and Reel; PartNumber: GRM155R60J475ME87D; RoHSCompliant: true; Tolerance: 20%; Width: 0.02 inch; Height: 0.5 mm; Mount: Surface Mount; PackageReference: 0402; Pins: 2; Radiation Hardening: No; REACH SVHC: No SVHC; Voltage Rating (DC): 6.3 V
C257 = E22: Chip Capacitor, 100 nF, +/- 10%, 6.3 V, -55 to 85 degC, 0201 (0603 Metric), RoHS, Tape and Reel; Manufacturer: Basic Passives; Тип элемента: Конденсатор; Capacitance: 100 nF; Case\/Package: 0201; Type (Capacitors): X5R; Voltage Rating: 6.3 V; Voltage Rating (DC): 3 V; Old_des: C428; New_des: C257; UID: E22; Component Kind: Standard; Case Code (Imperial): 0201; Case Code (Metric): 0603; ComponentLink1Description: Manufacturer URL; ComponentLink1URL: http://www.murata.com/; ComponentLink2Description: Datasheet; ComponentLink2URL: http://search.murata.co.jp/Ceramy/image/img/A01X/G101/ENG/GRM033R60J104KE19-01.pdf; DatasheetVersion: 03/2016; Length: 0.6 mm; Max Operating Temperature: 85 degC; Min Operating Temperature: -55 degC; Mounting Technology: Surface Mount; Package Quantity: 15000; PackageDescription: 2-Pin Surface Mount Device, Body 0.6 x 0.3 mm; Packaging: Tape and Reel; PartNumber: GRM033R60J104KE19D; RoHSCompliant: true; Tolerance: 10%; Width: 0.3 mm; Height: 0.3 mm; Mount: Surface Mount; PackageReference: 0201; Pins: 2; Radiation Hardening: No; REACH SVHC: No SVHC
C258 = E22: Chip Capacitor, 100 nF, +/- 10%, 6.3 V, -55 to 85 degC, 0201 (0603 Metric), RoHS, Tape and Reel; Manufacturer: Basic Passives; Тип элемента: Конденсатор; Capacitance: 100 nF; Case\/Package: 0201; Type (Capacitors): X5R; Voltage Rating: 6.3 V; Voltage Rating (DC): 3 V; Old_des: C469; New_des: C258; UID: E22; Component Kind: Standard; Case Code (Imperial): 0201; Case Code (Metric): 0603; ComponentLink1Description: Manufacturer URL; ComponentLink1URL: http://www.murata.com/; ComponentLink2Description: Datasheet; ComponentLink2URL: http://search.murata.co.jp/Ceramy/image/img/A01X/G101/ENG/GRM033R60J104KE19-01.pdf; DatasheetVersion: 03/2016; Length: 0.6 mm; Max Operating Temperature: 85 degC; Min Operating Temperature: -55 degC; Mounting Technology: Surface Mount; Package Quantity: 15000; PackageDescription: 2-Pin Surface Mount Device, Body 0.6 x 0.3 mm; Packaging: Tape and Reel; PartNumber: GRM033R60J104KE19D; RoHSCompliant: true; Tolerance: 10%; Width: 0.3 mm; Height: 0.3 mm; Mount: Surface Mount; PackageReference: 0201; Pins: 2; Radiation Hardening: No; REACH SVHC: No SVHC
C259 = E22: Chip Capacitor, 100 nF, +/- 10%, 6.3 V, -55 to 85 degC, 0201 (0603 Metric), RoHS, Tape and Reel; Manufacturer: Basic Passives; Тип элемента: Конденсатор; Capacitance: 100 nF; Case\/Package: 0201; Type (Capacitors): X5R; Voltage Rating: 6.3 V; Voltage Rating (DC): 3 V; Old_des: C449; New_des: C259; UID: E22; Component Kind: Standard; Case Code (Imperial): 0201; Case Code (Metric): 0603; ComponentLink1Description: Manufacturer URL; ComponentLink1URL: http://www.murata.com/; ComponentLink2Description: Datasheet; ComponentLink2URL: http://search.murata.co.jp/Ceramy/image/img/A01X/G101/ENG/GRM033R60J104KE19-01.pdf; DatasheetVersion: 03/2016; Length: 0.6 mm; Max Operating Temperature: 85 degC; Min Operating Temperature: -55 degC; Mounting Technology: Surface Mount; Package Quantity: 15000; PackageDescription: 2-Pin Surface Mount Device, Body 0.6 x 0.3 mm; Packaging: Tape and Reel; PartNumber: GRM033R60J104KE19D; RoHSCompliant: true; Tolerance: 10%; Width: 0.3 mm; Height: 0.3 mm; Mount: Surface Mount; PackageReference: 0201; Pins: 2; Radiation Hardening: No; REACH SVHC: No SVHC
C260 = E22: Chip Capacitor, 100 nF, +/- 10%, 6.3 V, -55 to 85 degC, 0201 (0603 Metric), RoHS, Tape and Reel; Manufacturer: Basic Passives; Тип элемента: Конденсатор; Capacitance: 100 nF; Case\/Package: 0201; Type (Capacitors): X5R; Voltage Rating: 6.3 V; Voltage Rating (DC): 3 V; Old_des: C396; New_des: C260; UID: E22; Component Kind: Standard; Case Code (Imperial): 0201; Case Code (Metric): 0603; ComponentLink1Description: Manufacturer URL; ComponentLink1URL: http://www.murata.com/; ComponentLink2Description: Datasheet; ComponentLink2URL: http://search.murata.co.jp/Ceramy/image/img/A01X/G101/ENG/GRM033R60J104KE19-01.pdf; DatasheetVersion: 03/2016; Length: 0.6 mm; Max Operating Temperature: 85 degC; Min Operating Temperature: -55 degC; Mounting Technology: Surface Mount; Package Quantity: 15000; PackageDescription: 2-Pin Surface Mount Device, Body 0.6 x 0.3 mm; Packaging: Tape and Reel; PartNumber: GRM033R60J104KE19D; RoHSCompliant: true; Tolerance: 10%; Width: 0.3 mm; Height: 0.3 mm; Mount: Surface Mount; PackageReference: 0201; Pins: 2; Radiation Hardening: No; REACH SVHC: No SVHC
C261 = E27: Chip Capacitor, 4.7 uF, +/- 20%, 6.3 V, -55 to 85 degC, 0402 (1005 Metric), RoHS, Tape and Reel; Manufacturer: Basic Passives; Тип элемента: Конденсатор; Capacitance: 4.7 uF; Case\/Package: 0402; Type (Capacitors): X5R; Voltage Rating: 6.3 V; Old_des: C412; New_des: C261; UID: E27; Component Kind: Standard; Case Code (Imperial): 0402; Case Code (Metric): 1005; ComponentLink1Description: Manufacturer URL; ComponentLink1URL: http://www.murata.com/; ComponentLink2Description: Datasheet; ComponentLink2URL: http://search.murata.co.jp/Ceramy/image/img/A01X/G101/ENG/GRM155R60J475ME87-01.pdf; DatasheetVersion: 03/2016; Length: 0.039 inch; Max Operating Temperature: 85 degC; Min Operating Temperature: -55 degC; Mounting Technology: Surface Mount; Package Quantity: 1; PackageDescription: 2-Pin Surface Mount Device, Body 1 x 0.5 mm; Packaging: Tape and Reel; PartNumber: GRM155R60J475ME87D; RoHSCompliant: true; Tolerance: 20%; Width: 0.02 inch; Height: 0.5 mm; Mount: Surface Mount; PackageReference: 0402; Pins: 2; Radiation Hardening: No; REACH SVHC: No SVHC; Voltage Rating (DC): 6.3 V
C262 = E22: Chip Capacitor, 100 nF, +/- 10%, 6.3 V, -55 to 85 degC, 0201 (0603 Metric), RoHS, Tape and Reel; Manufacturer: Basic Passives; Тип элемента: Конденсатор; Capacitance: 100 nF; Case\/Package: 0201; Type (Capacitors): X5R; Voltage Rating: 6.3 V; Voltage Rating (DC): 3 V; Old_des: C429; New_des: C262; UID: E22; Component Kind: Standard; Case Code (Imperial): 0201; Case Code (Metric): 0603; ComponentLink1Description: Manufacturer URL; ComponentLink1URL: http://www.murata.com/; ComponentLink2Description: Datasheet; ComponentLink2URL: http://search.murata.co.jp/Ceramy/image/img/A01X/G101/ENG/GRM033R60J104KE19-01.pdf; DatasheetVersion: 03/2016; Length: 0.6 mm; Max Operating Temperature: 85 degC; Min Operating Temperature: -55 degC; Mounting Technology: Surface Mount; Package Quantity: 15000; PackageDescription: 2-Pin Surface Mount Device, Body 0.6 x 0.3 mm; Packaging: Tape and Reel; PartNumber: GRM033R60J104KE19D; RoHSCompliant: true; Tolerance: 10%; Width: 0.3 mm; Height: 0.3 mm; Mount: Surface Mount; PackageReference: 0201; Pins: 2; Radiation Hardening: No; REACH SVHC: No SVHC
C263 = E22: Chip Capacitor, 100 nF, +/- 10%, 6.3 V, -55 to 85 degC, 0201 (0603 Metric), RoHS, Tape and Reel; Manufacturer: Basic Passives; Тип элемента: Конденсатор; Capacitance: 100 nF; Case\/Package: 0201; Type (Capacitors): X5R; Voltage Rating: 6.3 V; Voltage Rating (DC): 3 V; Old_des: C470; New_des: C263; UID: E22; Component Kind: Standard; Case Code (Imperial): 0201; Case Code (Metric): 0603; ComponentLink1Description: Manufacturer URL; ComponentLink1URL: http://www.murata.com/; ComponentLink2Description: Datasheet; ComponentLink2URL: http://search.murata.co.jp/Ceramy/image/img/A01X/G101/ENG/GRM033R60J104KE19-01.pdf; DatasheetVersion: 03/2016; Length: 0.6 mm; Max Operating Temperature: 85 degC; Min Operating Temperature: -55 degC; Mounting Technology: Surface Mount; Package Quantity: 15000; PackageDescription: 2-Pin Surface Mount Device, Body 0.6 x 0.3 mm; Packaging: Tape and Reel; PartNumber: GRM033R60J104KE19D; RoHSCompliant: true; Tolerance: 10%; Width: 0.3 mm; Height: 0.3 mm; Mount: Surface Mount; PackageReference: 0201; Pins: 2; Radiation Hardening: No; REACH SVHC: No SVHC
C264 = E22: Chip Capacitor, 100 nF, +/- 10%, 6.3 V, -55 to 85 degC, 0201 (0603 Metric), RoHS, Tape and Reel; Manufacturer: Basic Passives; Тип элемента: Конденсатор; Capacitance: 100 nF; Case\/Package: 0201; Type (Capacitors): X5R; Voltage Rating: 6.3 V; Voltage Rating (DC): 3 V; Old_des: C450; New_des: C264; UID: E22; Component Kind: Standard; Case Code (Imperial): 0201; Case Code (Metric): 0603; ComponentLink1Description: Manufacturer URL; ComponentLink1URL: http://www.murata.com/; ComponentLink2Description: Datasheet; ComponentLink2URL: http://search.murata.co.jp/Ceramy/image/img/A01X/G101/ENG/GRM033R60J104KE19-01.pdf; DatasheetVersion: 03/2016; Length: 0.6 mm; Max Operating Temperature: 85 degC; Min Operating Temperature: -55 degC; Mounting Technology: Surface Mount; Package Quantity: 15000; PackageDescription: 2-Pin Surface Mount Device, Body 0.6 x 0.3 mm; Packaging: Tape and Reel; PartNumber: GRM033R60J104KE19D; RoHSCompliant: true; Tolerance: 10%; Width: 0.3 mm; Height: 0.3 mm; Mount: Surface Mount; PackageReference: 0201; Pins: 2; Radiation Hardening: No; REACH SVHC: No SVHC
C265 = E22: Chip Capacitor, 100 nF, +/- 10%, 6.3 V, -55 to 85 degC, 0201 (0603 Metric), RoHS, Tape and Reel; Manufacturer: Basic Passives; Тип элемента: Конденсатор; Capacitance: 100 nF; Case\/Package: 0201; Type (Capacitors): X5R; Voltage Rating: 6.3 V; Voltage Rating (DC): 3 V; Old_des: C397; New_des: C265; UID: E22; Component Kind: Standard; Case Code (Imperial): 0201; Case Code (Metric): 0603; ComponentLink1Description: Manufacturer URL; ComponentLink1URL: http://www.murata.com/; ComponentLink2Description: Datasheet; ComponentLink2URL: http://search.murata.co.jp/Ceramy/image/img/A01X/G101/ENG/GRM033R60J104KE19-01.pdf; DatasheetVersion: 03/2016; Length: 0.6 mm; Max Operating Temperature: 85 degC; Min Operating Temperature: -55 degC; Mounting Technology: Surface Mount; Package Quantity: 15000; PackageDescription: 2-Pin Surface Mount Device, Body 0.6 x 0.3 mm; Packaging: Tape and Reel; PartNumber: GRM033R60J104KE19D; RoHSCompliant: true; Tolerance: 10%; Width: 0.3 mm; Height: 0.3 mm; Mount: Surface Mount; PackageReference: 0201; Pins: 2; Radiation Hardening: No; REACH SVHC: No SVHC
C266 = E27: Chip Capacitor, 4.7 uF, +/- 20%, 6.3 V, -55 to 85 degC, 0402 (1005 Metric), RoHS, Tape and Reel; Manufacturer: Basic Passives; Тип элемента: Конденсатор; Capacitance: 4.7 uF; Case\/Package: 0402; Type (Capacitors): X5R; Voltage Rating: 6.3 V; Old_des: C413; New_des: C266; UID: E27; Component Kind: Standard; Case Code (Imperial): 0402; Case Code (Metric): 1005; ComponentLink1Description: Manufacturer URL; ComponentLink1URL: http://www.murata.com/; ComponentLink2Description: Datasheet; ComponentLink2URL: http://search.murata.co.jp/Ceramy/image/img/A01X/G101/ENG/GRM155R60J475ME87-01.pdf; DatasheetVersion: 03/2016; Length: 0.039 inch; Max Operating Temperature: 85 degC; Min Operating Temperature: -55 degC; Mounting Technology: Surface Mount; Package Quantity: 1; PackageDescription: 2-Pin Surface Mount Device, Body 1 x 0.5 mm; Packaging: Tape and Reel; PartNumber: GRM155R60J475ME87D; RoHSCompliant: true; Tolerance: 20%; Width: 0.02 inch; Height: 0.5 mm; Mount: Surface Mount; PackageReference: 0402; Pins: 2; Radiation Hardening: No; REACH SVHC: No SVHC; Voltage Rating (DC): 6.3 V
C267 = E22: Chip Capacitor, 100 nF, +/- 10%, 6.3 V, -55 to 85 degC, 0201 (0603 Metric), RoHS, Tape and Reel; Manufacturer: Basic Passives; Тип элемента: Конденсатор; Capacitance: 100 nF; Case\/Package: 0201; Type (Capacitors): X5R; Voltage Rating: 6.3 V; Voltage Rating (DC): 3 V; Old_des: C430; New_des: C267; UID: E22; Component Kind: Standard; Case Code (Imperial): 0201; Case Code (Metric): 0603; ComponentLink1Description: Manufacturer URL; ComponentLink1URL: http://www.murata.com/; ComponentLink2Description: Datasheet; ComponentLink2URL: http://search.murata.co.jp/Ceramy/image/img/A01X/G101/ENG/GRM033R60J104KE19-01.pdf; DatasheetVersion: 03/2016; Length: 0.6 mm; Max Operating Temperature: 85 degC; Min Operating Temperature: -55 degC; Mounting Technology: Surface Mount; Package Quantity: 15000; PackageDescription: 2-Pin Surface Mount Device, Body 0.6 x 0.3 mm; Packaging: Tape and Reel; PartNumber: GRM033R60J104KE19D; RoHSCompliant: true; Tolerance: 10%; Width: 0.3 mm; Height: 0.3 mm; Mount: Surface Mount; PackageReference: 0201; Pins: 2; Radiation Hardening: No; REACH SVHC: No SVHC
C268 = E22: Chip Capacitor, 100 nF, +/- 10%, 6.3 V, -55 to 85 degC, 0201 (0603 Metric), RoHS, Tape and Reel; Manufacturer: Basic Passives; Тип элемента: Конденсатор; Capacitance: 100 nF; Case\/Package: 0201; Type (Capacitors): X5R; Voltage Rating: 6.3 V; Voltage Rating (DC): 3 V; Old_des: C471; New_des: C268; UID: E22; Component Kind: Standard; Case Code (Imperial): 0201; Case Code (Metric): 0603; ComponentLink1Description: Manufacturer URL; ComponentLink1URL: http://www.murata.com/; ComponentLink2Description: Datasheet; ComponentLink2URL: http://search.murata.co.jp/Ceramy/image/img/A01X/G101/ENG/GRM033R60J104KE19-01.pdf; DatasheetVersion: 03/2016; Length: 0.6 mm; Max Operating Temperature: 85 degC; Min Operating Temperature: -55 degC; Mounting Technology: Surface Mount; Package Quantity: 15000; PackageDescription: 2-Pin Surface Mount Device, Body 0.6 x 0.3 mm; Packaging: Tape and Reel; PartNumber: GRM033R60J104KE19D; RoHSCompliant: true; Tolerance: 10%; Width: 0.3 mm; Height: 0.3 mm; Mount: Surface Mount; PackageReference: 0201; Pins: 2; Radiation Hardening: No; REACH SVHC: No SVHC
C269 = E22: Chip Capacitor, 100 nF, +/- 10%, 6.3 V, -55 to 85 degC, 0201 (0603 Metric), RoHS, Tape and Reel; Manufacturer: Basic Passives; Тип элемента: Конденсатор; Capacitance: 100 nF; Case\/Package: 0201; Type (Capacitors): X5R; Voltage Rating: 6.3 V; Voltage Rating (DC): 3 V; Old_des: C451; New_des: C269; UID: E22; Component Kind: Standard; Case Code (Imperial): 0201; Case Code (Metric): 0603; ComponentLink1Description: Manufacturer URL; ComponentLink1URL: http://www.murata.com/; ComponentLink2Description: Datasheet; ComponentLink2URL: http://search.murata.co.jp/Ceramy/image/img/A01X/G101/ENG/GRM033R60J104KE19-01.pdf; DatasheetVersion: 03/2016; Length: 0.6 mm; Max Operating Temperature: 85 degC; Min Operating Temperature: -55 degC; Mounting Technology: Surface Mount; Package Quantity: 15000; PackageDescription: 2-Pin Surface Mount Device, Body 0.6 x 0.3 mm; Packaging: Tape and Reel; PartNumber: GRM033R60J104KE19D; RoHSCompliant: true; Tolerance: 10%; Width: 0.3 mm; Height: 0.3 mm; Mount: Surface Mount; PackageReference: 0201; Pins: 2; Radiation Hardening: No; REACH SVHC: No SVHC
C270 = E22: Chip Capacitor, 100 nF, +/- 10%, 6.3 V, -55 to 85 degC, 0201 (0603 Metric), RoHS, Tape and Reel; Manufacturer: Basic Passives; Тип элемента: Конденсатор; Capacitance: 100 nF; Case\/Package: 0201; Type (Capacitors): X5R; Voltage Rating: 6.3 V; Voltage Rating (DC): 3 V; Old_des: C398; New_des: C270; UID: E22; Component Kind: Standard; Case Code (Imperial): 0201; Case Code (Metric): 0603; ComponentLink1Description: Manufacturer URL; ComponentLink1URL: http://www.murata.com/; ComponentLink2Description: Datasheet; ComponentLink2URL: http://search.murata.co.jp/Ceramy/image/img/A01X/G101/ENG/GRM033R60J104KE19-01.pdf; DatasheetVersion: 03/2016; Length: 0.6 mm; Max Operating Temperature: 85 degC; Min Operating Temperature: -55 degC; Mounting Technology: Surface Mount; Package Quantity: 15000; PackageDescription: 2-Pin Surface Mount Device, Body 0.6 x 0.3 mm; Packaging: Tape and Reel; PartNumber: GRM033R60J104KE19D; RoHSCompliant: true; Tolerance: 10%; Width: 0.3 mm; Height: 0.3 mm; Mount: Surface Mount; PackageReference: 0201; Pins: 2; Radiation Hardening: No; REACH SVHC: No SVHC
C271 = E27: Chip Capacitor, 4.7 uF, +/- 20%, 6.3 V, -55 to 85 degC, 0402 (1005 Metric), RoHS, Tape and Reel; Manufacturer: Basic Passives; Тип элемента: Конденсатор; Capacitance: 4.7 uF; Case\/Package: 0402; Type (Capacitors): X5R; Voltage Rating: 6.3 V; Old_des: C414; New_des: C271; UID: E27; Component Kind: Standard; Case Code (Imperial): 0402; Case Code (Metric): 1005; ComponentLink1Description: Manufacturer URL; ComponentLink1URL: http://www.murata.com/; ComponentLink2Description: Datasheet; ComponentLink2URL: http://search.murata.co.jp/Ceramy/image/img/A01X/G101/ENG/GRM155R60J475ME87-01.pdf; DatasheetVersion: 03/2016; Length: 0.039 inch; Max Operating Temperature: 85 degC; Min Operating Temperature: -55 degC; Mounting Technology: Surface Mount; Package Quantity: 1; PackageDescription: 2-Pin Surface Mount Device, Body 1 x 0.5 mm; Packaging: Tape and Reel; PartNumber: GRM155R60J475ME87D; RoHSCompliant: true; Tolerance: 20%; Width: 0.02 inch; Height: 0.5 mm; Mount: Surface Mount; PackageReference: 0402; Pins: 2; Radiation Hardening: No; REACH SVHC: No SVHC; Voltage Rating (DC): 6.3 V
C272 = E22: Chip Capacitor, 100 nF, +/- 10%, 6.3 V, -55 to 85 degC, 0201 (0603 Metric), RoHS, Tape and Reel; Manufacturer: Basic Passives; Тип элемента: Конденсатор; Capacitance: 100 nF; Case\/Package: 0201; Type (Capacitors): X5R; Voltage Rating: 6.3 V; Voltage Rating (DC): 3 V; Old_des: C431; New_des: C272; UID: E22; Component Kind: Standard; Case Code (Imperial): 0201; Case Code (Metric): 0603; ComponentLink1Description: Manufacturer URL; ComponentLink1URL: http://www.murata.com/; ComponentLink2Description: Datasheet; ComponentLink2URL: http://search.murata.co.jp/Ceramy/image/img/A01X/G101/ENG/GRM033R60J104KE19-01.pdf; DatasheetVersion: 03/2016; Length: 0.6 mm; Max Operating Temperature: 85 degC; Min Operating Temperature: -55 degC; Mounting Technology: Surface Mount; Package Quantity: 15000; PackageDescription: 2-Pin Surface Mount Device, Body 0.6 x 0.3 mm; Packaging: Tape and Reel; PartNumber: GRM033R60J104KE19D; RoHSCompliant: true; Tolerance: 10%; Width: 0.3 mm; Height: 0.3 mm; Mount: Surface Mount; PackageReference: 0201; Pins: 2; Radiation Hardening: No; REACH SVHC: No SVHC
C273 = E22: Chip Capacitor, 100 nF, +/- 10%, 6.3 V, -55 to 85 degC, 0201 (0603 Metric), RoHS, Tape and Reel; Manufacturer: Basic Passives; Тип элемента: Конденсатор; Capacitance: 100 nF; Case\/Package: 0201; Type (Capacitors): X5R; Voltage Rating: 6.3 V; Voltage Rating (DC): 3 V; Old_des: C472; New_des: C273; UID: E22; Component Kind: Standard; Case Code (Imperial): 0201; Case Code (Metric): 0603; ComponentLink1Description: Manufacturer URL; ComponentLink1URL: http://www.murata.com/; ComponentLink2Description: Datasheet; ComponentLink2URL: http://search.murata.co.jp/Ceramy/image/img/A01X/G101/ENG/GRM033R60J104KE19-01.pdf; DatasheetVersion: 03/2016; Length: 0.6 mm; Max Operating Temperature: 85 degC; Min Operating Temperature: -55 degC; Mounting Technology: Surface Mount; Package Quantity: 15000; PackageDescription: 2-Pin Surface Mount Device, Body 0.6 x 0.3 mm; Packaging: Tape and Reel; PartNumber: GRM033R60J104KE19D; RoHSCompliant: true; Tolerance: 10%; Width: 0.3 mm; Height: 0.3 mm; Mount: Surface Mount; PackageReference: 0201; Pins: 2; Radiation Hardening: No; REACH SVHC: No SVHC
C274 = E22: Chip Capacitor, 100 nF, +/- 10%, 6.3 V, -55 to 85 degC, 0201 (0603 Metric), RoHS, Tape and Reel; Manufacturer: Basic Passives; Тип элемента: Конденсатор; Capacitance: 100 nF; Case\/Package: 0201; Type (Capacitors): X5R; Voltage Rating: 6.3 V; Voltage Rating (DC): 3 V; Old_des: C452; New_des: C274; UID: E22; Component Kind: Standard; Case Code (Imperial): 0201; Case Code (Metric): 0603; ComponentLink1Description: Manufacturer URL; ComponentLink1URL: http://www.murata.com/; ComponentLink2Description: Datasheet; ComponentLink2URL: http://search.murata.co.jp/Ceramy/image/img/A01X/G101/ENG/GRM033R60J104KE19-01.pdf; DatasheetVersion: 03/2016; Length: 0.6 mm; Max Operating Temperature: 85 degC; Min Operating Temperature: -55 degC; Mounting Technology: Surface Mount; Package Quantity: 15000; PackageDescription: 2-Pin Surface Mount Device, Body 0.6 x 0.3 mm; Packaging: Tape and Reel; PartNumber: GRM033R60J104KE19D; RoHSCompliant: true; Tolerance: 10%; Width: 0.3 mm; Height: 0.3 mm; Mount: Surface Mount; PackageReference: 0201; Pins: 2; Radiation Hardening: No; REACH SVHC: No SVHC